# EAGLE design shutter_board (EAGLE 7.7.0)
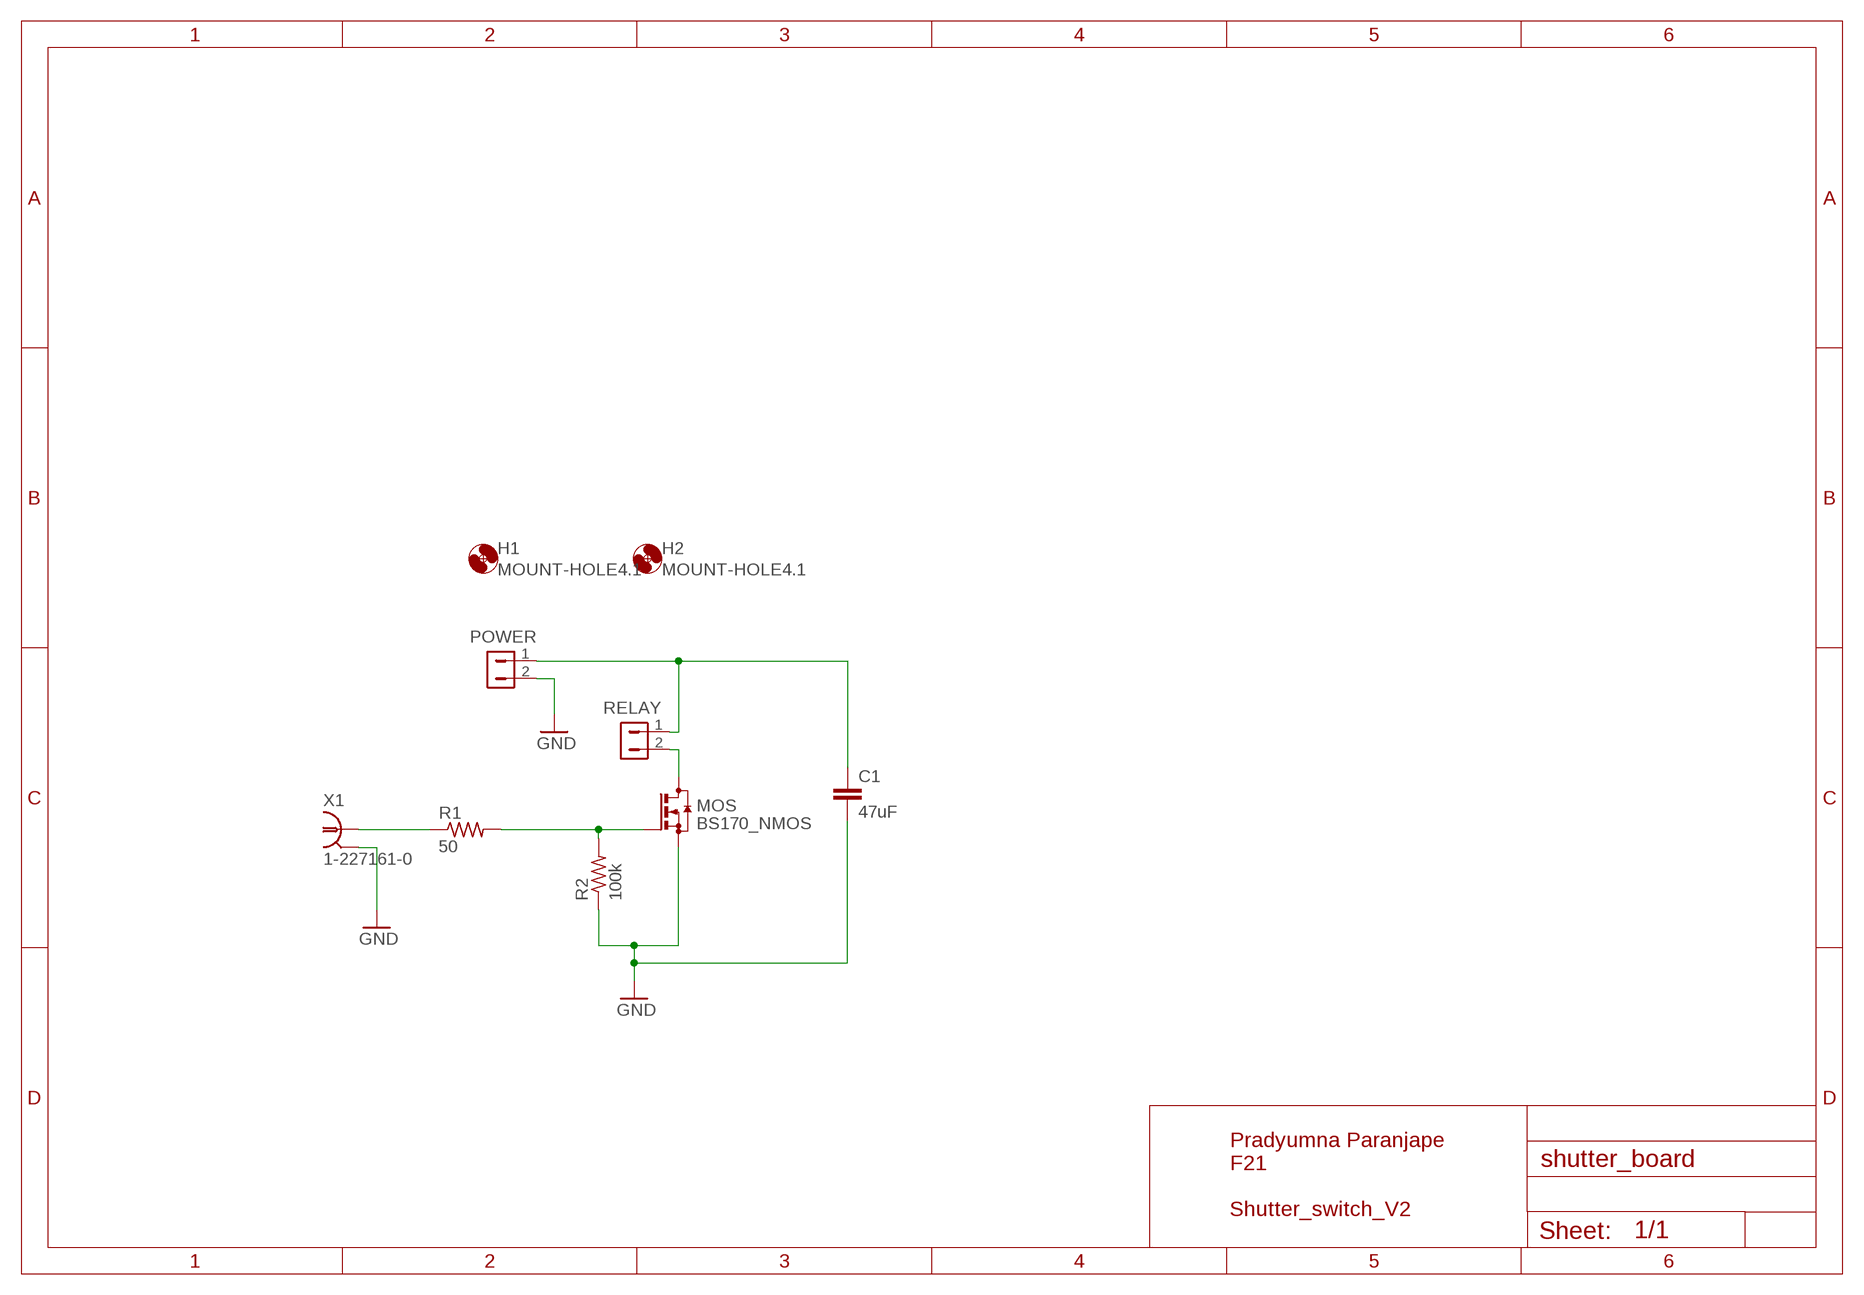
[diagram p0: schematic, sheet 1]

## Parts
C1  47uF  NALI_CAPACITOR  [NALI_CAP]
H1  MOUNT-HOLE4.1  [4,1]
H2  MOUNT-HOLE4.1  [4,1]
MOS  BS170_NMOS  [TO92-3]
POWER  2PIN_CONNECTOR  [KK2_MOLEX]
R1  50  SMALL_RESIS  [SMALL_RESIS]
R2  100k  SMALL_RESIS  [SMALL_RESIS]
RELAY  2PIN_CONNECTOR  [KK2_MOLEX]
X1  1-227161-0  [AMP_227161]

## Nets
GND: C1.2 MOS.3(S) POWER.2 R2.1 X1.2
N$1: R1.1 X1.1
N$2: MOS.2(G) R1.2 R2.2
N$6: C1.1 POWER.1 RELAY.1
N$7: MOS.1(D) RELAY.2

## Notes on the sheet
- Pradyumna Paranjape
  F21
  
  Shutter_switch_V2

## Library data of the parts
C1 = Pra_NaLi_devices:NALI_CAPACITOR
H1 H2 = holes:MOUNT-HOLE: MOUNTING HOLE with drill center marker
MOS = Pra_NaLi_devices:BS170_NMOS
POWER RELAY = Pra_NaLi_devices:2PIN_CONNECTOR
R1 R2 = Pra_NaLi_devices:SMALL_RESIS
X1 = con-coax:?227161*: JACK, RIGHT ANGLE, 50 OHM, PCB, BNC Source: amp_227161.pdf; MF: TYCO ELECTRONICS; MPN: 1-227161; OC_FARNELL: unknown; OC_NEWARK: 33B3200

## Net classes
0 default: width 0.381 mm, drill 0.381 mm, clearance 0.508 mm

## Board
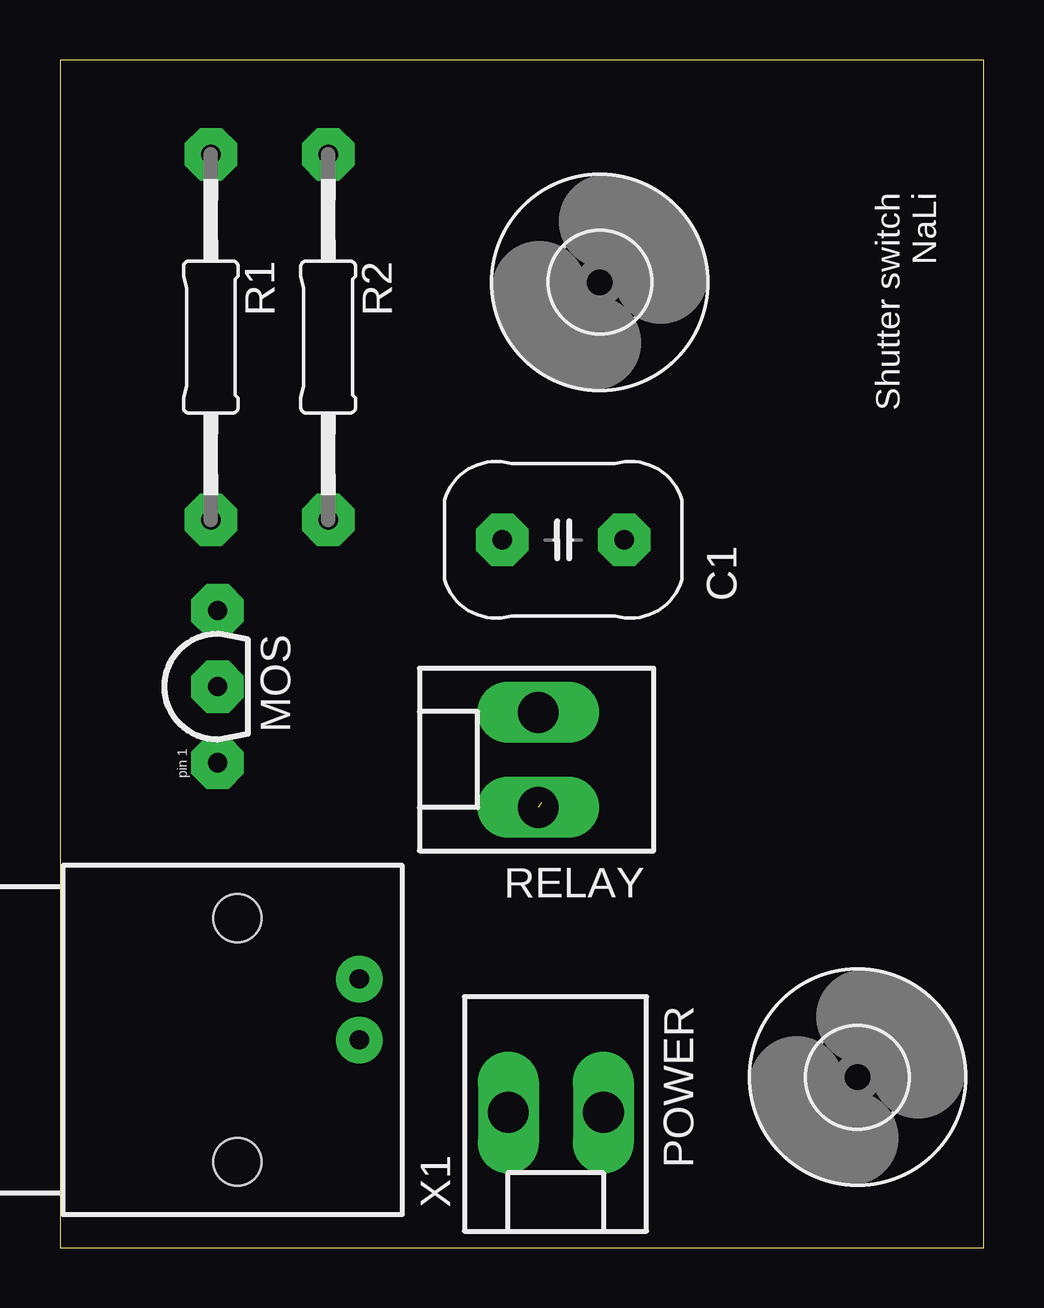
[diagram p1: board, top side]
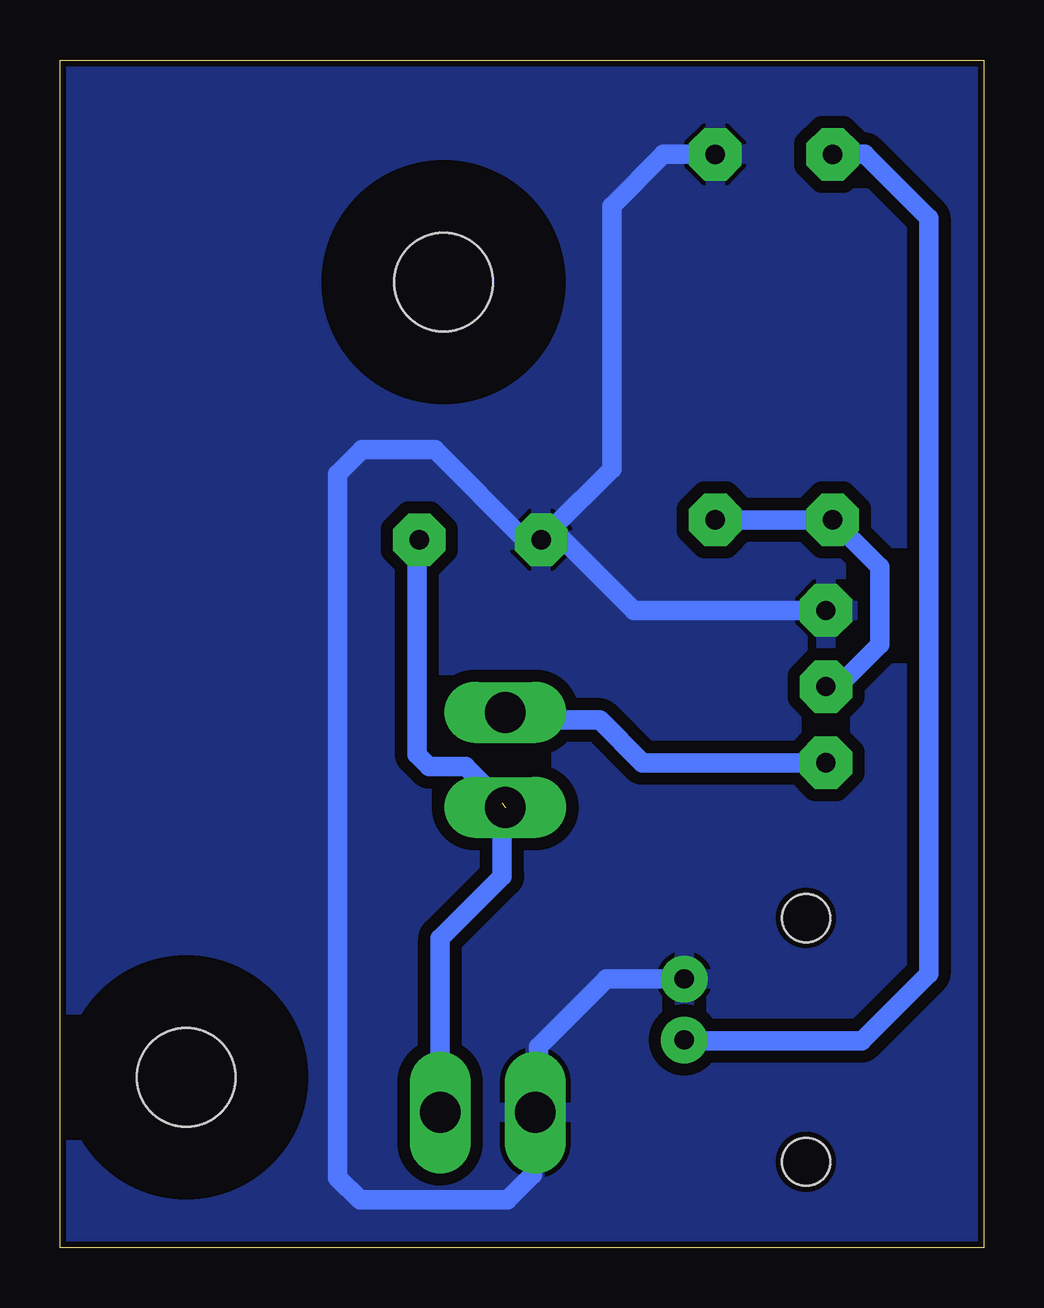
[diagram p2: board, bottom side, seen from below]

Size 38.5 x 49.52 mm. Coordinates in mm from the lower left corner, seen from the top.
Outline: 0,0 38.5,0 38.5,49.52 0,49.52 0,0
Copper layers (1*16): Top 0.105mm / dielectric 1.55mm / Bottom 0.105mm
Design rules "eC_2Layer_PClass3_BaseCopperO105": minimum track width 0.25mm, minimum drill 0.35mm, track to track 0.3mm, track to pad 0.3mm, pad to pad 0.3mm, via to via 0.3mm, smd to smd 0mil, copper to edge 0.25mm, drill to drill 0.35mm, minimum pad ring 0.25mm, minimum via ring 0.2mm, stop-mask expansion 0mil, vias tented up to drill 0.45mm, thermal gap 0.2mm

### Footprints (pad centres in the part's own frame; a part is rotated, then mirrored left to right if it is on the bottom)
NALI_CAP = drill 0.813 pad 2.184 octagon: 1 -2.54,0; 2 2.54,0
4,1 = hole 4.1: 0,0
TO92-3 = drill 0.8 pad 2.184 octagon: 1 -3.175,0; 2 0,0; 3 3.175,0
KK2_MOLEX = drill 1.7 pad 2.54 long: 1 -1.98,0; 2 1.98,0
SMALL_RESIS = drill 0.813 pad 2.184 octagon: 1 -7.62,0; 2 7.62,0
AMP_227161 = drill 0.8 pad 1.93: 1 0,-5.08; 2 2.54,-5.08 | hole 2: -5.08,0; 5.08,0

### Placement (x,y rotation side)
C1  20.98,29.52 180 top
H1  22.51,40.25 0 top
H2  33.24,7.12 0 top
MOS  6.57,23.4 90 top
POWER  20.67,5.65 180 top
R1  6.29,37.97 270 top
R2  11.18,37.97 270 top
RELAY  19.93,20.35 90 top
X1  7.4,8.67 90 top

### Tracks (layer width: path | path; a pad name or v marks a point on that pad's centre or on a via)
GND
  Bottom 0.813: R2.1 13.34,45.59 15.49,43.43 15.49,32.47 17.98,29.98 | 17.98,29.98 C1.2 19.11,29.52 22.86,33.27 25.91,33.27 26.92,32.26 26.92,2.92 26,2 19.84,2 18.8,3.05 18.8,5.54 POWER.2 18.54,5.8 18.54,8.38 15.71,11.21 X1.2 | MOS.3 14.57,26.57 17.98,29.98 | 18,30 17.98,29.98
  pour Bottom: 0,50 40,50 40,0 0,0
N$1
  Bottom 0.813: R1.1 4.95,45.59 2.29,42.93 2.29,11.43 5.08,8.64 12.44,8.64 X1.1
N$2
  Bottom 0.813: R2.2 R1.2 4.32,28.38 4.32,25.15 6.06,23.4 MOS.2
N$6  (1 unrouted)
  Bottom 0.813: POWER.1 22.65,12.91 20.07,15.49 20.07,18.54 21.59,20.07 23.11,20.07 23.62,20.57 23.62,29.42 C1.1
N$7
  Bottom 0.813: MOS.1 14.22,20.23 16,22 19.61,22 RELAY.2

### Text on the board
tNames: Shutter switch / NaLi